# Altium schematic sheet RF & wireless.SchDoc
size A; SheetNumber: 5; SheetTotal: 10
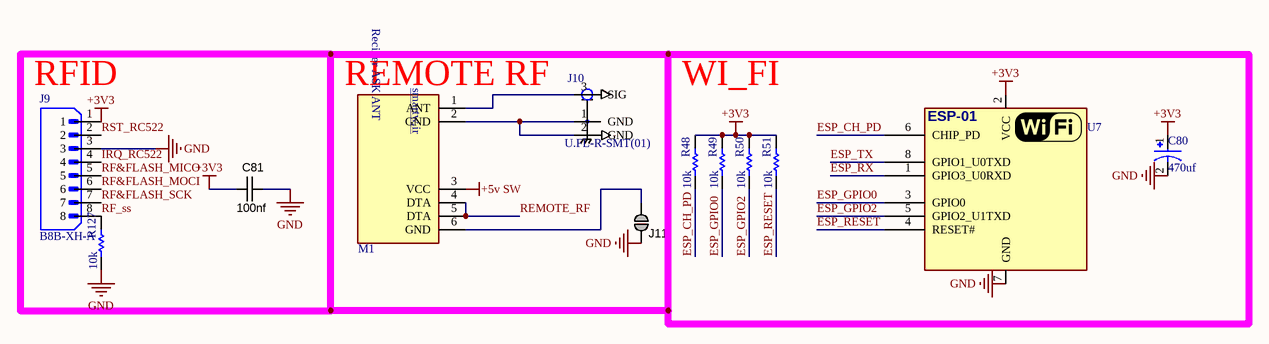
[diagram p0: RF & wireless.SchDoc]

## Parts
C80  470uf  [CAP_4TPB330ML]
C81  100nf  [CAPC1608X90N]
J9  B8B-XH-A  [JST_B8B-XH-A]
J10  U.FL-R-SMT(01)  [UFL]
J11  Jumper  [JUMP1]  (value not drawn)  (no BOM)
M1  ASK RF ANT 315/433MHZ  [RF_ETRXB]  (value not drawn)
R48  10k  [Resistor_SMD_0603 (1608)]
R49  10k  [Resistor_SMD_0603 (1608)]
R50  10k  [Resistor_SMD_0603 (1608)]
R51  10k  [Resistor_SMD_0603 (1608)]
R127  10k  [Resistor_SMD_0603 (1608)]
U7  ESP-01  [ESP8266_ESP01]  (value not drawn)

## Nets
+3V3: C80.1 C81.1 J9.1 R48.1 R49.1 R50.1 R51.1 U7.2(VCC)
+5v SW: M1.3(VCC)
GND: C80.2 C81.2 J9.3 J11.2 R127.2 U7.7(GND)
ESP_CH_PD: R48.2 U7.6(CHIP_PD)
ESP_GPIO0: R49.2 U7.3(GPIO0)
ESP_GPIO2: R50.2 U7.5(GPIO2_U1TXD)
ESP_RESET: R51.2 U7.4(RESET#)
ESP_RX: U7.1(GPIO3_U0RXD)
ESP_TX: U7.8(GPIO1_U0TXD)
IRQ_RC522: J9.4
REMOTE_RF: M1.4(DTA) M1.5(DTA)
RF&FLASH_MICO: J9.5
RF&FLASH_MOCI: J9.6
RF&FLASH_SCK: J9.7
RF_ss: J9.8 R127.1
RST_RC522: J9.2
NetJ10_1: J10.1(GND) J10.2(GND) M1.2(GND)
NetJ10_3: J10.3(SIG) M1.1(ANT)
NetJ11_1: J11.1 M1.6(GND)

## Notes on the sheet
- (near J9) RFID
- (near M1) REMOTE RF
- WI_FI
- (in symbol ASK RF ANT 315/433MHZ) Reciver ASK ANT; smartw.ir

## Library data of the parts
C80 = 4TPB330ML: CAP, 330ÂµF, 4V, 20%, 2917, SMD; Capacitance:330ÂµF; Voltage Rating:4V; Product Range:-; Capacitance Tolerance:Â± 20%; Manufacturer Size Code:D; ESR:0.04ohm; Operating Temperature Min:-55Â°C; Operating Temperature Max:105Â°C; Automotive Qualification Standard:-; Capacitance Tolerance Â±:Â± 20%; Capacitor Case Style:2917 [7343 Metric]; Capacitor Mounting:SMD; Capacitor Terminals:SMD; DC Ripple Current:2000mA; External Depth:2.8mm; External Length / Height:7.3mm; External Width:4.3mm; Leakage Current:132ÂµA; No. of Pins:2Pins; Operating Temperature Range:-55Â°C to +105Â°C; Reel Quantity:2500; Tantalum Capacitor Case:2917 [7343 Metric]; Tape Width:12mm; Tolerance +:20%; Tolerance -:20%; Voltage Rating V DC:4V; MF: Sanyo Electric; Availability: In Stock; Package: None; MP: 4TPB330ML; Value: *; Price: None; SnapEDA_Link: https://www.snapeda.com/parts/4TPB330ML/Sanyo/view-part/?ref=snap; Check_prices: https://www.snapeda.com/parts/4TPB330ML/Sanyo/view-part/?ref=eda
C81 = CAPC_100n_0603_X7R_50V_10%: Capacitor SMD Cer 100nF 10% 50V X7R 0603; Manufacturer 1: AVX Corporation; Manufacturer Part Number 1: 06035C104KAT2A; Ratings: 50V; X7R; Material: ceramic; SCDType: spec; Value: 100n; Manufacturer 2: TDK Corporation; Manufacturer Part Number 2: C1608X7R1H104K; Package / Case: 0603 (1608 Metric); Tolerance: ±10%; Supplier 1: Digi-Key; Supplier Part Number 1: 478-5052-1-ND; ComponentLink1URL: http://www.avx.com/docs/Catalogs/cx7r.pdf; ComponentLink1Description: http://www.avx.com/docs/Catalogs/cx7r.pdf; Supplier 2: Digi-Key; Supplier Part Number 2: 445-1314-1-ND; ComponentLink2URL: http://product.tdk.com/capacitor/mlcc/en/documents/mlcc_commercial_general_en.pdf; ComponentLink2Description: http://product.tdk.com/capacitor/mlcc/en/documents/mlcc_commercial_general_en.pdf
J9 = B8B-XH-A: Connector Header Through Hole 8 position 0.098 (2.50mm); MF: JST; SnapEDA_Link: https://www.snapeda.com/parts/B8B-XH-A/JST/view-part/?ref=snap; Package: None; Value: *; MP: B8B-XH-A; Check_prices: https://www.snapeda.com/parts/B8B-XH-A/JST/view-part/?ref=eda
J10 = U.FL-R-SMT(01): U.FL Series 6 Ghz 50 Ohm Ultra-small SMT Coaxial Cable Receptacle; MF: Hirose; MP: U.FL-R-SMT(01); Price: 0.87 USD; Package: None; Availability: Good; Value: *
J11 = JUMP1: SMD jumper
R48-R51 = Resistor: Resistor 0603; Email: razi.vesali@gmail.com; Published: 17-Jun-2016; LatestRevisionNote: Re-released for puplic; Publisher: Seyed Razi Vesali; Value: 10k
R127 = Resistor: Email: razi.vesali@gmail.com; Published: 17-Jun-2016; LatestRevisionNote: Re-released for puplic; Publisher: Seyed Razi Vesali; Value: 10k
U7 = ESP8266_ESP-01: ESP8266 ESP-01 WiFi Module; MANF_P#: ESP-01; VALUE: ESP-01
M1 = ASK RF ANT 315/433MHZ: ComponentLink1Description: Website Smart World; ComponentLink1URL: https://www.smartw.ir/; ComponentLink2Description: Telegram; ComponentLink2URL: https://t.me/altium_smartw; ComponentLink3Description: Instagram; ComponentLink3URL: https://Instagram.com/smartgw.ir; DatasheetVersion: 2021